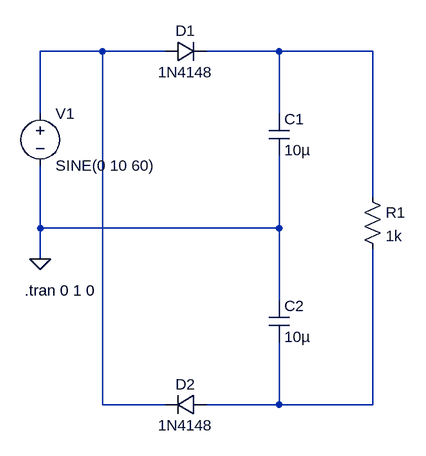
[diagram p0: schematic 3EEC_VELASCO_EXPT8_CKT2.asc]
3EEC_VELASCO_EXPT8_CKT2.asc, the LTspice schematic file:
Version 4
SHEET 1 880 680
WIRE 176 -16 80 -16
WIRE 272 -16 176 -16
WIRE 448 -16 336 -16
WIRE 592 -16 448 -16
WIRE 80 80 80 -16
WIRE 448 80 448 -16
WIRE 592 208 592 -16
WIRE 80 256 80 160
WIRE 448 256 448 144
WIRE 448 256 80 256
WIRE 80 304 80 256
WIRE 448 368 448 256
WIRE 176 528 176 -16
WIRE 272 528 176 528
WIRE 448 528 448 432
WIRE 448 528 336 528
WIRE 592 528 592 288
WIRE 592 528 448 528
FLAG 80 304 0
SYMBOL voltage 80 64 R0
SYMATTR InstName V1
SYMATTR Value SINE(0 10 60)
SYMBOL diode 272 0 R270
WINDOW 0 32 32 VTop 2
WINDOW 3 0 32 VBottom 2
SYMATTR InstName D1
SYMATTR Value 1N4148
SYMBOL cap 432 80 R0
SYMATTR InstName C1
SYMATTR Value 10µ
SYMBOL cap 432 368 R0
SYMATTR InstName C2
SYMATTR Value 10µ
SYMBOL diode 336 512 R90
WINDOW 0 0 32 VBottom 2
WINDOW 3 32 32 VTop 2
SYMATTR InstName D2
SYMATTR Value 1N4148
SYMBOL res 576 192 R0
SYMATTR InstName R1
SYMATTR Value 1k
TEXT 56 352 Left 2 !.tran 0 1 0

The netlist it stands for:
* 3EEC_VELASCO_EXPT8_CKT2.asc
V1 N001 0 SINE(0 10 60)
D1 N001 N002 1N4148
C1 N002 0 10µ
C2 0 N003 10µ
D2 N003 N001 1N4148
R1 N002 N003 1k
.model D D
.lib standard.dio
.tran 0 1 0
.backanno
.end